# EAGLE design Board_ESP32_2Bluepill (EAGLE 9.7.0)
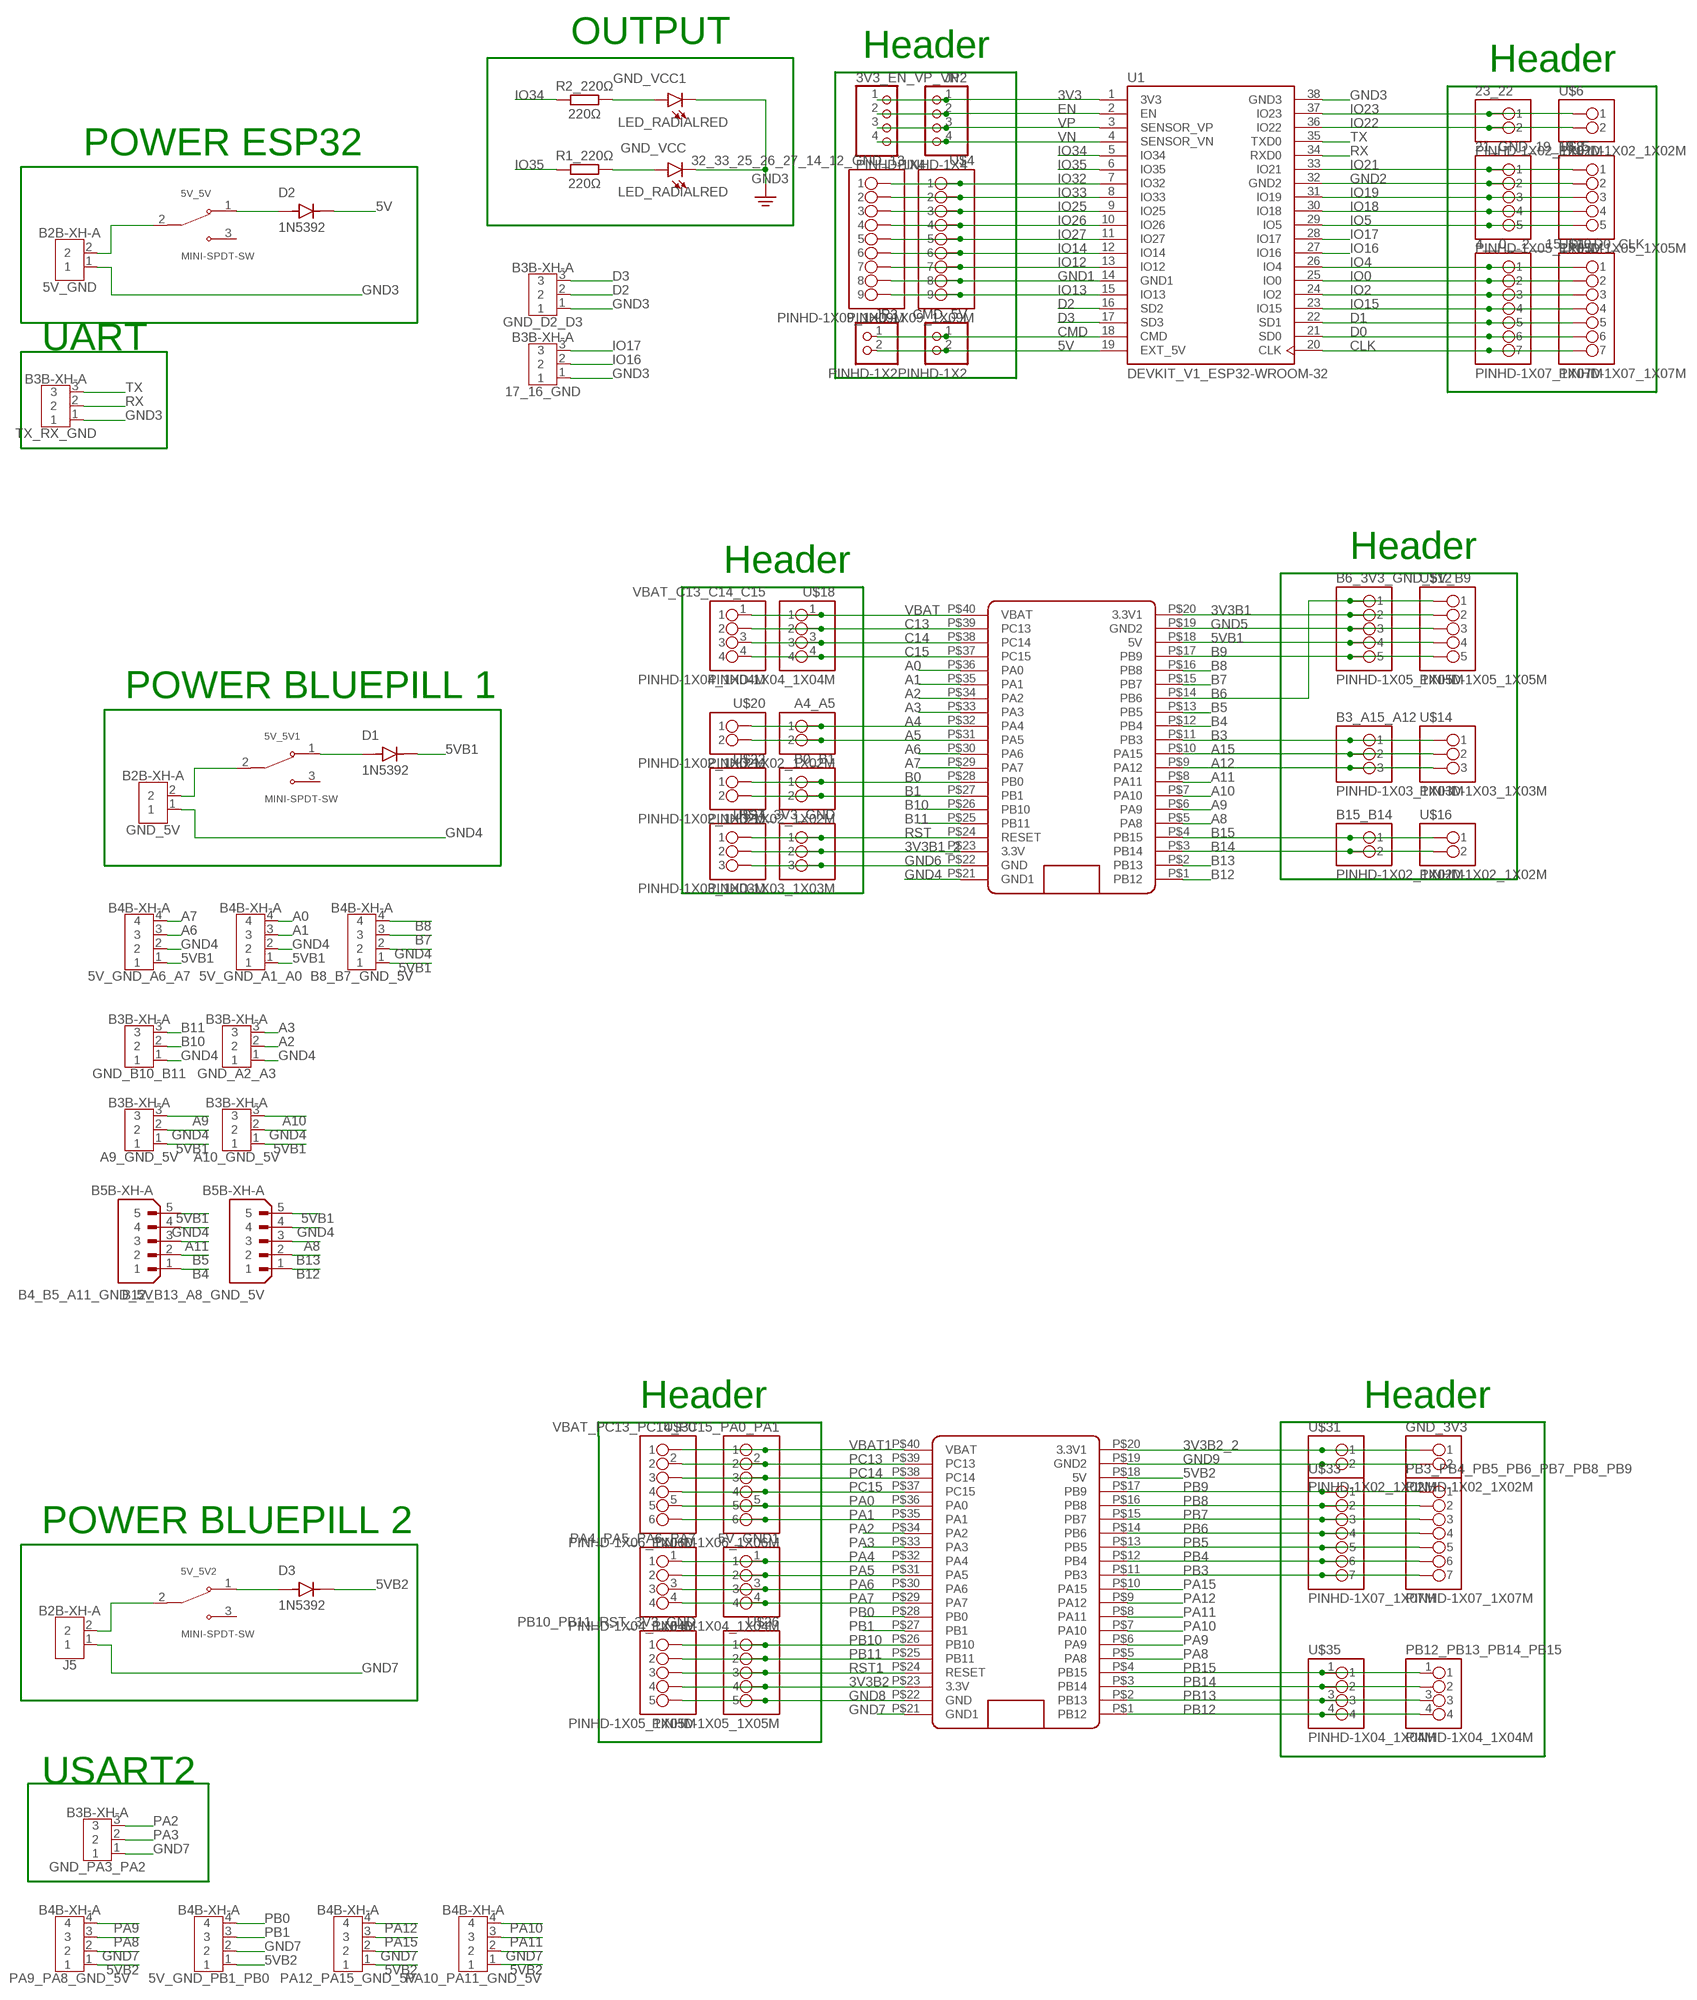
[diagram p0: schematic, sheet 1]

## Parts
3V3_EN_VP_VN  PINHD-1X4  [1X04]
4__0__2__15_D1_D0_CLK  PINHD-1X07_1X07M  [1X07]
5V_5V  MINI-SPDT-SW  [SW_MINI-SPDT-SW]
5V_5V1  MINI-SPDT-SW  [SW_MINI-SPDT-SW]
5V_5V2  MINI-SPDT-SW  [SW_MINI-SPDT-SW]
5V_GND  B2B-XH-A  [B2B-XH-A]
5V_GND1  PINHD-1X04_1X04M  [1X04]
5V_GND_A1_A0  B4B-XH-A  [B4B-XH-A]
5V_GND_A6_A7  B4B-XH-A  [B4B-XH-A]
5V_GND_PB1_PB0  B4B-XH-A  [B4B-XH-A]
17_16_GND  B3B-XH-A  [B3B-XH-A]
21_GND_19_18_5  PINHD-1X05_1X05M  [1X05]
23_22  PINHD-1X02_1X02M  [1X02]
32_33_25_26_27_14_12_GND_13  PINHD-1X09_1X09M  [1X09]
A4_A5  PINHD-1X02_1X02M  [1X02]
A9_GND_5V  B3B-XH-A  [B3B-XH-A]
A10_GND_5V  B3B-XH-A  [B3B-XH-A]
B0_B1  PINHD-1X02_1X02M  [1X02]
B3_A15_A12  PINHD-1X03_1X03M  [1X03]
B4_B5_A11_GND_5V  B5B-XH-A  [JST_B5B-XH-A]
B6_3V3_GND_5V_B9  PINHD-1X05_1X05M  [1X05]
B8_B7_GND_5V  B4B-XH-A  [B4B-XH-A]
B12_B13_A8_GND_5V  B5B-XH-A  [JST_B5B-XH-A]
B15_B14  PINHD-1X02_1X02M  [1X02]
CMD_5V  PINHD-1X2  [1X02]
D1  1N5392  [DIOAD1300W80L670D310]
D2  1N5392  [DIOAD1300W80L670D310]
D3  1N5392  [DIOAD1300W80L670D310]
GND_3V3  PINHD-1X02_1X02M  [1X02]
GND_5V  B2B-XH-A  [B2B-XH-A]
GND_A2_A3  B3B-XH-A  [B3B-XH-A]
GND_B10_B11  B3B-XH-A  [B3B-XH-A]
GND_D2_D3  B3B-XH-A  [B3B-XH-A]
GND_PA3_PA2  B3B-XH-A  [B3B-XH-A]
GND_VCC  LED_RADIALRED  [LEDRD254W60D565H860B_R]
GND_VCC1  LED_RADIALRED  [LEDRD254W60D565H860B_R]
J5  B2B-XH-A  [B2B-XH-A]
JP2  PINHD-1X4  [1X04]
JP3  PINHD-1X2  [1X02]
PA4_PA5_PA6_PA7  PINHD-1X04_1X04M  [1X04]
PA9_PA8_GND_5V  B4B-XH-A  [B4B-XH-A]
PA10_PA11_GND_5V  B4B-XH-A  [B4B-XH-A]
PA12_PA15_GND_5V  B4B-XH-A  [B4B-XH-A]
PB3_PB4_PB5_PB6_PB7_PB8_PB9  PINHD-1X07_1X07M  [1X07]
PB10_PB11_RST_3V3_GND  PINHD-1X05_1X05M  [1X05]
PB12_PB13_PB14_PB15  PINHD-1X04_1X04M  [1X04]
R1_220Ω  220Ω  R_AXIAL-11.7MM-PITCH  [RESAD1176W63L850D250B]
R2_220Ω  220Ω  R_AXIAL-11.7MM-PITCH  [RESAD1176W63L850D250B]
RST_3V3_GND  PINHD-1X03_1X03M  [1X03]
TX_RX_GND  B3B-XH-A  [B3B-XH-A]
U1  DEVKIT_V1_ESP32-WROOM-32  [MODULE_DEVKIT_V1_ESP32-WROOM-32]
U$1  BLUE_PILL  [BLUE_PILL]
U$2  BLUE_PILL  [BLUE_PILL]
U$4  PINHD-1X09_1X09M  [1X09]
U$6  PINHD-1X02_1X02M  [1X02]
U$8  PINHD-1X05_1X05M  [1X05]
U$10  PINHD-1X07_1X07M  [1X07]
U$12  PINHD-1X05_1X05M  [1X05]
U$14  PINHD-1X03_1X03M  [1X03]
U$16  PINHD-1X02_1X02M  [1X02]
U$18  PINHD-1X04_1X04M  [1X04]
U$20  PINHD-1X02_1X02M  [1X02]
U$22  PINHD-1X02_1X02M  [1X02]
U$24  PINHD-1X03_1X03M  [1X03]
U$26  PINHD-1X05_1X05M  [1X05]
U$30  PINHD-1X06_1X06M  [1X06]
U$31  PINHD-1X02_1X02M  [1X02]
U$33  PINHD-1X07_1X07M  [1X07]
U$35  PINHD-1X04_1X04M  [1X04]
VBAT_C13_C14_C15  PINHD-1X04_1X04M  [1X04]
VBAT_PC13_PC14_PC15_PA0_PA1  PINHD-1X06_1X06M  [1X06]

## Nets
3V3: 3V3_EN_VP_VN.1 JP2.1 U1.1(3V3)
3V3B1: B6_3V3_GND_5V_B9.2 U$1.P$20(3.3V1) U$12.2
3V3B1_2: RST_3V3_GND.2 U$1.P$23(3.3V) U$24.2
3V3B2: PB10_PB11_RST_3V3_GND.4 U$2.P$23(3.3V) U$26.4
3V3B2_2: GND_3V3.1 U$2.P$20(3.3V1) U$31.1
5V: CMD_5V.2 D2.C(K) JP3.2 U1.19(EXT_5V)
5V_FB1: 5V_5V.2 5V_GND.2
5V_FB2: 5V_5V1.2 GND_5V.2
5V_FB3: 5V_5V2.2 J5.2
5VB1: 5V_GND_A1_A0.1 5V_GND_A6_A7.1 A9_GND_5V.1 A10_GND_5V.1 B4_B5_A11_GND_5V.5 B6_3V3_GND_5V_B9.4 B8_B7_GND_5V.1 B12_B13_A8_GND_5V.5 D1.C(K) U$1.P$18(5V) U$12.4
5VB2: 5V_GND_PB1_PB0.1 D3.C(K) PA9_PA8_GND_5V.1 PA10_PA11_GND_5V.1 PA12_PA15_GND_5V.1 U$2.P$18(5V)
A0: 5V_GND_A1_A0.4 U$1.P$36(PA0)
A1: 5V_GND_A1_A0.3 U$1.P$35(PA1)
A2: GND_A2_A3.2 U$1.P$34(PA2)
A3: GND_A2_A3.3 U$1.P$33(PA3)
A4: A4_A5.1 U$1.P$32(PA4) U$20.1
A5: A4_A5.2 U$1.P$31(PA5) U$20.2
A6: 5V_GND_A6_A7.3 U$1.P$30(PA6)
A7: 5V_GND_A6_A7.4 U$1.P$29(PA7)
A8: B12_B13_A8_GND_5V.3 U$1.P$5(PA8)
A9: A9_GND_5V.3 U$1.P$6(PA9)
A10: A10_GND_5V.3 U$1.P$7(PA10)
A11: B4_B5_A11_GND_5V.3 U$1.P$8(PA11)
A12: B3_A15_A12.3 U$1.P$9(PA12) U$14.3
A15: B3_A15_A12.2 U$1.P$10(PA15) U$14.2
B0: B0_B1.1 U$1.P$28(PB0) U$22.1
B1: B0_B1.2 U$1.P$27(PB1) U$22.2
B3: B3_A15_A12.1 U$1.P$11(PB3) U$14.1
B4: B4_B5_A11_GND_5V.1 U$1.P$12(PB4)
B5: B4_B5_A11_GND_5V.2 U$1.P$13(PB5)
B6: B6_3V3_GND_5V_B9.1 U$1.P$14(PB6) U$12.1
B7: B8_B7_GND_5V.3 U$1.P$15(PB7)
B8: B8_B7_GND_5V.4 U$1.P$16(PB8)
B9: B6_3V3_GND_5V_B9.5 U$1.P$17(PB9) U$12.5
B10: GND_B10_B11.2 U$1.P$26(PB10)
B11: GND_B10_B11.3 U$1.P$25(PB11)
B12: B12_B13_A8_GND_5V.1 U$1.P$1(PB12)
B13: B12_B13_A8_GND_5V.2 U$1.P$2(PB13)
B14: B15_B14.2 U$1.P$3(PB14) U$16.2
B15: B15_B14.1 U$1.P$4(PB15) U$16.1
C13: U$1.P$39(PC13) U$18.2 VBAT_C13_C14_C15.2
C14: U$1.P$38(PC14) U$18.3 VBAT_C13_C14_C15.3
C15: U$1.P$37(PC15) U$18.4 VBAT_C13_C14_C15.4
CLK: 4__0__2__15_D1_D0_CLK.7 U1.20(CLK) U$10.7
CMD: CMD_5V.1 JP3.1 U1.18(CMD)
D0: 4__0__2__15_D1_D0_CLK.6 U1.21(SD0) U$10.6
D1: 4__0__2__15_D1_D0_CLK.5 U1.22(SD1) U$10.5
D2: GND_D2_D3.2 U1.16(SD2)
D3: GND_D2_D3.3 U1.17(SD3)
EN: 3V3_EN_VP_VN.2 JP2.2 U1.2(EN)
GND1: 32_33_25_26_27_14_12_GND_13.8 U1.14(GND1) U$4.8
GND2: 21_GND_19_18_5.2 U1.32(GND2) U$8.2
GND3: 5V_GND.1 17_16_GND.1 GND_D2_D3.1 GND_VCC1.C GND_VCC.C TX_RX_GND.1 U1.38(GND3) ; supply symbol labelled GND
GND4: 5V_GND_A1_A0.2 5V_GND_A6_A7.2 A9_GND_5V.2 A10_GND_5V.2 B4_B5_A11_GND_5V.4 B8_B7_GND_5V.2 B12_B13_A8_GND_5V.4 GND_5V.1 GND_A2_A3.1 GND_B10_B11.1 U$1.P$21(GND1)
GND5: B6_3V3_GND_5V_B9.3 U$1.P$19(GND2) U$12.3
GND6: RST_3V3_GND.3 U$1.P$22(GND) U$24.3
GND7: 5V_GND_PB1_PB0.2 GND_PA3_PA2.1 J5.1 PA9_PA8_GND_5V.2 PA10_PA11_GND_5V.2 PA12_PA15_GND_5V.2 U$2.P$21(GND1)
GND8: PB10_PB11_RST_3V3_GND.5 U$2.P$22(GND) U$26.5
GND9: GND_3V3.2 U$2.P$19(GND2) U$31.2
IO0: 4__0__2__15_D1_D0_CLK.2 U1.25(IO0) U$10.2
IO2: 4__0__2__15_D1_D0_CLK.3 U1.24(IO2) U$10.3
IO4: 4__0__2__15_D1_D0_CLK.1 U1.26(IO4) U$10.1
IO5: 21_GND_19_18_5.5 U1.29(IO5) U$8.5
IO12: 32_33_25_26_27_14_12_GND_13.7 U1.13(IO12) U$4.7
IO13: 32_33_25_26_27_14_12_GND_13.9 U1.15(IO13) U$4.9
IO14: 32_33_25_26_27_14_12_GND_13.6 U1.12(IO14) U$4.6
IO15: 4__0__2__15_D1_D0_CLK.4 U1.23(IO15) U$10.4
IO16: 17_16_GND.2 U1.27(IO16)
IO17: 17_16_GND.3 U1.28(IO17)
IO18: 21_GND_19_18_5.4 U1.30(IO18) U$8.4
IO19: 21_GND_19_18_5.3 U1.31(IO19) U$8.3
IO21: 21_GND_19_18_5.1 U1.33(IO21) U$8.1
IO22: 23_22.2 U1.36(IO22) U$6.2
IO23: 23_22.1 U1.37(IO23) U$6.1
IO25: 32_33_25_26_27_14_12_GND_13.3 U1.9(IO25) U$4.3
IO26: 32_33_25_26_27_14_12_GND_13.4 U1.10(IO26) U$4.4
IO27: 32_33_25_26_27_14_12_GND_13.5 U1.11(IO27) U$4.5
IO32: 32_33_25_26_27_14_12_GND_13.1 U1.7(IO32) U$4.1
IO33: 32_33_25_26_27_14_12_GND_13.2 U1.8(IO33) U$4.2
IO34: R2_220Ω.1 U1.5(IO34)
IO35: R1_220Ω.1 U1.6(IO35)
N$1: GND_VCC1.A R2_220Ω.2
N$2: GND_VCC.A R1_220Ω.2
N$9: 5V_5V.1 D2.A
N$19: 5V_5V2.1 D3.A
N$20: 5V_5V1.1 D1.A
PA0: U$2.P$36(PA0) U$30.5 VBAT_PC13_PC14_PC15_PA0_PA1.5
PA1: U$2.P$35(PA1) U$30.6 VBAT_PC13_PC14_PC15_PA0_PA1.6
PA2: GND_PA3_PA2.3 U$2.P$34(PA2)
PA3: GND_PA3_PA2.2 U$2.P$33(PA3)
PA4: 5V_GND1.1 PA4_PA5_PA6_PA7.1 U$2.P$32(PA4)
PA5: 5V_GND1.2 PA4_PA5_PA6_PA7.2 U$2.P$31(PA5)
PA6: 5V_GND1.3 PA4_PA5_PA6_PA7.3 U$2.P$30(PA6)
PA7: 5V_GND1.4 PA4_PA5_PA6_PA7.4 U$2.P$29(PA7)
PA8: PA9_PA8_GND_5V.3 U$2.P$5(PA8)
PA9: PA9_PA8_GND_5V.4 U$2.P$6(PA9)
PA10: PA10_PA11_GND_5V.4 U$2.P$7(PA10)
PA11: PA10_PA11_GND_5V.3 U$2.P$8(PA11)
PA12: PA12_PA15_GND_5V.4 U$2.P$9(PA12)
PA15: PA12_PA15_GND_5V.3 U$2.P$10(PA15)
PB0: 5V_GND_PB1_PB0.4 U$2.P$28(PB0)
PB1: 5V_GND_PB1_PB0.3 U$2.P$27(PB1)
PB3: PB3_PB4_PB5_PB6_PB7_PB8_PB9.7 U$2.P$11(PB3) U$33.7
PB4: PB3_PB4_PB5_PB6_PB7_PB8_PB9.6 U$2.P$12(PB4) U$33.6
PB5: PB3_PB4_PB5_PB6_PB7_PB8_PB9.5 U$2.P$13(PB5) U$33.5
PB6: PB3_PB4_PB5_PB6_PB7_PB8_PB9.4 U$2.P$14(PB6) U$33.4
PB7: PB3_PB4_PB5_PB6_PB7_PB8_PB9.3 U$2.P$15(PB7) U$33.3
PB8: PB3_PB4_PB5_PB6_PB7_PB8_PB9.2 U$2.P$16(PB8) U$33.2
PB9: PB3_PB4_PB5_PB6_PB7_PB8_PB9.1 U$2.P$17(PB9) U$33.1
PB10: PB10_PB11_RST_3V3_GND.1 U$2.P$26(PB10) U$26.1
PB11: PB10_PB11_RST_3V3_GND.2 U$2.P$25(PB11) U$26.2
PB12: PB12_PB13_PB14_PB15.4 U$2.P$1(PB12) U$35.4
PB13: PB12_PB13_PB14_PB15.3 U$2.P$2(PB13) U$35.3
PB14: PB12_PB13_PB14_PB15.2 U$2.P$3(PB14) U$35.2
PB15: PB12_PB13_PB14_PB15.1 U$2.P$4(PB15) U$35.1
PC13: U$2.P$39(PC13) U$30.2 VBAT_PC13_PC14_PC15_PA0_PA1.2
PC14: U$2.P$38(PC14) U$30.3 VBAT_PC13_PC14_PC15_PA0_PA1.3
PC15: U$2.P$37(PC15) U$30.4 VBAT_PC13_PC14_PC15_PA0_PA1.4
RST: RST_3V3_GND.1 U$1.P$24(RESET) U$24.1
RST1: PB10_PB11_RST_3V3_GND.3 U$2.P$24(RESET) U$26.3
RX: TX_RX_GND.2 U1.34(RXD0)
TX: TX_RX_GND.3 U1.35(TXD0)
VBAT: U$1.P$40(VBAT) U$18.1 VBAT_C13_C14_C15.1
VBAT1: U$2.P$40(VBAT) U$30.1 VBAT_PC13_PC14_PC15_PA0_PA1.1
VN: 3V3_EN_VP_VN.4 JP2.4 U1.4(SENSOR_VN)
VP: 3V3_EN_VP_VN.3 JP2.3 U1.3(SENSOR_VP)
Unconnected: 5V_5V1.3 5V_5V2.3 5V_5V.3

## Buses
B$1
B$2
B$3
B$4
B$5
B$6

## Notes on the sheet
- OUTPUT
- Header
- Header
- POWER ESP32
- UART
- Header
- Header
- POWER BLUEPILL 1
- Header | Header
- POWER BLUEPILL 2
- USART2

## Library data of the parts
3V3_EN_VP_VN JP2 = Connector:PINHD-1X4: PIN HEADER; CATEGORY: Headers; DESCRIPTION: Header-Straight-4 Position; PACKAGE_TYPE: THT; PITCH: 0.100" (2.54mm); SUBCATEGORY: Headers-Male Pins; TYPE: Board to Board or Cable-Unshrouded-Through Hole-Straight
4__0__2__15_D1_D0_CLK PB3_PB4_PB5_PB6_PB7_PB8_PB9 U$10 U$33 = Tinkercad:PINHD-1X07
5V_5V 5V_5V1 5V_5V2 = MINI-SPDT-SW:MINI-SPDT-SW: Simple breadboard friendly SPDT slide switch. Rated at 30V/200mA with operating force of 250 +/-100gf. Check availability <https://pricing.snapeda.com/parts/MINI-SPDT-SW/Gravitech/view-part?ref=eda>; AVAILABILITY: Not in stock; CHECK_PRICES: https://www.snapeda.com/parts/MINI-SPDT-SW/Gravitech/view-part/?ref=eda; DESCRIPTION: Slide Switches MINI SPDT SWITCH; MF: Gravitech; MP: MINI-SPDT-SW; PACKAGE: None; PRICE: None; SNAPEDA_LINK: https://www.snapeda.com/parts/MINI-SPDT-SW/Gravitech/view-part/?ref=snap
5V_GND GND_5V J5 = Connector:B2B-XH-A: XH Connector Top Entry - 2POS Details see: Datasheet <http://www.jst-mfg.com/product/pdf/eng/eXH.pdf>; CATEGORY: Header; DATASHEET: https://www.jst-mfg.com/product/pdf/eng/eXH.pdf?67404de0bbae1; DESCRIPTION: Connector Header Through Hole 2 position 0.098" (2.50mm); MANUFACTURER: JST Sales America Inc.; MPN: B2B-XH-A; OPERATING_TEMPERATURE: -25°C ~ 85°C; PACKAGE_SIZE: NA; PACKAGE_TYPE: THT; PART_STATUS: ACTIVE; PITCH: 0.098" (2.50mm); ROHS: COMPLIANT; SERIES: XH; SUBCATEGORY: Rectangular Connectors; TYPE: Header-Male Pin-Board to Cable/Wire-Through Hole
5V_GND1 PA4_PA5_PA6_PA7 PB12_PB13_PB14_PB15 U$18 U$35 VBAT_C13_C14_C15 = Tinkercad:PINHD-1X04
5V_GND_A1_A0 5V_GND_A6_A7 5V_GND_PB1_PB0 B8_B7_GND_5V PA9_PA8_GND_5V PA10_PA11_GND_5V PA12_PA15_GND_5V = Connector:B4B-XH-A: XH Connector Top Entry - 4POS Details see: Datasheet <http://www.jst-mfg.com/product/pdf/eng/eXH.pdf>; CATEGORY: Header; DATASHEET: https://www.jst-mfg.com/product/pdf/eng/eXH.pdf?67404de0bbae1; DESCRIPTION: Connector Header Through Hole 4 position 0.098" (2.50mm); MANUFACTURER: JST Sales America Inc.; MPN: B4B-XH-A; OPERATING_TEMPERATURE: -25°C ~ 85°C; PACKAGE_SIZE: NA; PACKAGE_TYPE: THT; PART_STATUS: ACTIVE; PITCH: 0.098" (2.50mm); ROHS: COMPLIANT; SERIES: XH; SUBCATEGORY: Rectangular Connectors; TYPE: Header-Male Pin-Board to Cable/Wire-Through Hole
17_16_GND A9_GND_5V A10_GND_5V GND_A2_A3 GND_B10_B11 GND_D2_D3 GND_PA3_PA2 TX_RX_GND = Connector:B3B-XH-A: XH Connector Top Entry - 3POS Details see: Datasheet <http://www.jst-mfg.com/product/pdf/eng/eXH.pdf>; CATEGORY: Header; DATASHEET: https://www.jst-mfg.com/product/pdf/eng/eXH.pdf?67404de0bbae1; DESCRIPTION: Connector Header Through Hole 3 position 0.098" (2.50mm); MANUFACTURER: JST Sales America Inc.; MPN: B3B-XH-A; OPERATING_TEMPERATURE: -25°C ~ 85°C; PACKAGE_SIZE: NA; PACKAGE_TYPE: THT; PART_STATUS: ACTIVE; PITCH: 0.098" (2.50mm); ROHS: COMPLIANT; SERIES: XH; SUBCATEGORY: Rectangular Connectors; TYPE: Header-Male Pin-Board to Cable/Wire-Through Hole
21_GND_19_18_5 B6_3V3_GND_5V_B9 PB10_PB11_RST_3V3_GND U$8 U$12 U$26 = Tinkercad:PINHD-1X05
23_22 A4_A5 B0_B1 B15_B14 GND_3V3 U$6 U$16 U$20 U$22 U$31 = Tinkercad:PINHD-1X02
32_33_25_26_27_14_12_GND_13 U$4 = Tinkercad:PINHD-1X09
B3_A15_A12 RST_3V3_GND U$14 U$24 = Tinkercad:PINHD-1X03
B4_B5_A11_GND_5V B12_B13_A8_GND_5V = B5B-XH-A:B5B-XH-A: Check availability <https://pricing.snapeda.com/parts/B5B-XH-A/JST%20Sales/view-part?ref=eda>; AVAILABILITY: In Stock; CHECK_PRICES: https://www.snapeda.com/parts/B5B-XH-A/JST/view-part/?ref=eda; DESCRIPTION: Connector Header Through Hole 5 position 0.098 (2.50mm); MF: JST Sales; MP: B5B-XH-A; PACKAGE: None; PRICE: None; SNAPEDA_LINK: https://www.snapeda.com/parts/B5B-XH-A/JST/view-part/?ref=snap
CMD_5V JP3 = Connector:PINHD-1X2: PIN HEADER; CATEGORY: Headers; DESCRIPTION: Header-Straight-2 Position; PACKAGE_TYPE: THT; PITCH: 0.100" (2.54mm); SUBCATEGORY: Headers-Male Pins; TYPE: Board to Board or Cable-Unshrouded-Through Hole-Straight
D1-D3 = 1N5392:1N5392: Check availability <https://pricing.snapeda.com/parts/1N5392/ON%20Semiconductor/view-part?ref=eda>; AVAILABILITY: In Stock; CHECK_PRICES: https://www.snapeda.com/parts/1N5392/Onsemi/view-part/?ref=eda; DESCRIPTION: Diode Standard 100 V 1.5A Through Hole DO-15; MF: ON Semiconductor; MP: 1N5392; PACKAGE: None; PRICE: None; SNAPEDA_LINK: https://www.snapeda.com/parts/1N5392/Onsemi/view-part/?ref=snap
GND_VCC GND_VCC1 = Opto-Electronic:LED_RADIAL: LED - Generic
R1_220Ω R2_220Ω = Resistor:R: Resistor Fixed - Generic; CATEGORY: Resistor; SUB-CATEGORY: Fixed
U1 = DEVKIT_V1_ESP32-WROOM-32:DEVKIT_V1_ESP32-WROOM-32: Check availability <https://pricing.snapeda.com/parts/DEVKIT%20V1%20ESP32-WROOM-32/Espressif%20Systems/view-part?ref=eda>; AVAILABILITY: Not in stock; CHECK_PRICES: https://www.snapeda.com/parts/DEVKIT%20V1%20ESP32-WROOM-32/Espressif+Systems/view-part/?ref=eda; DESCRIPTION: WROOM-32 Development Board ESP32 ESP-32S WiFi Bluetooth Dev Module; MF: Espressif Systems; MP: DEVKIT V1 ESP32-WROOM-32; PACKAGE: Package; PRICE: None; SNAPEDA_LINK: https://www.snapeda.com/parts/DEVKIT%20V1%20ESP32-WROOM-32/Espressif+Systems/view-part/?ref=snap
U$1 U$2 = BluePill:BLUE_PILL
U$30 VBAT_PC13_PC14_PC15_PA0_PA1 = Tinkercad:PINHD-1X06

## Board
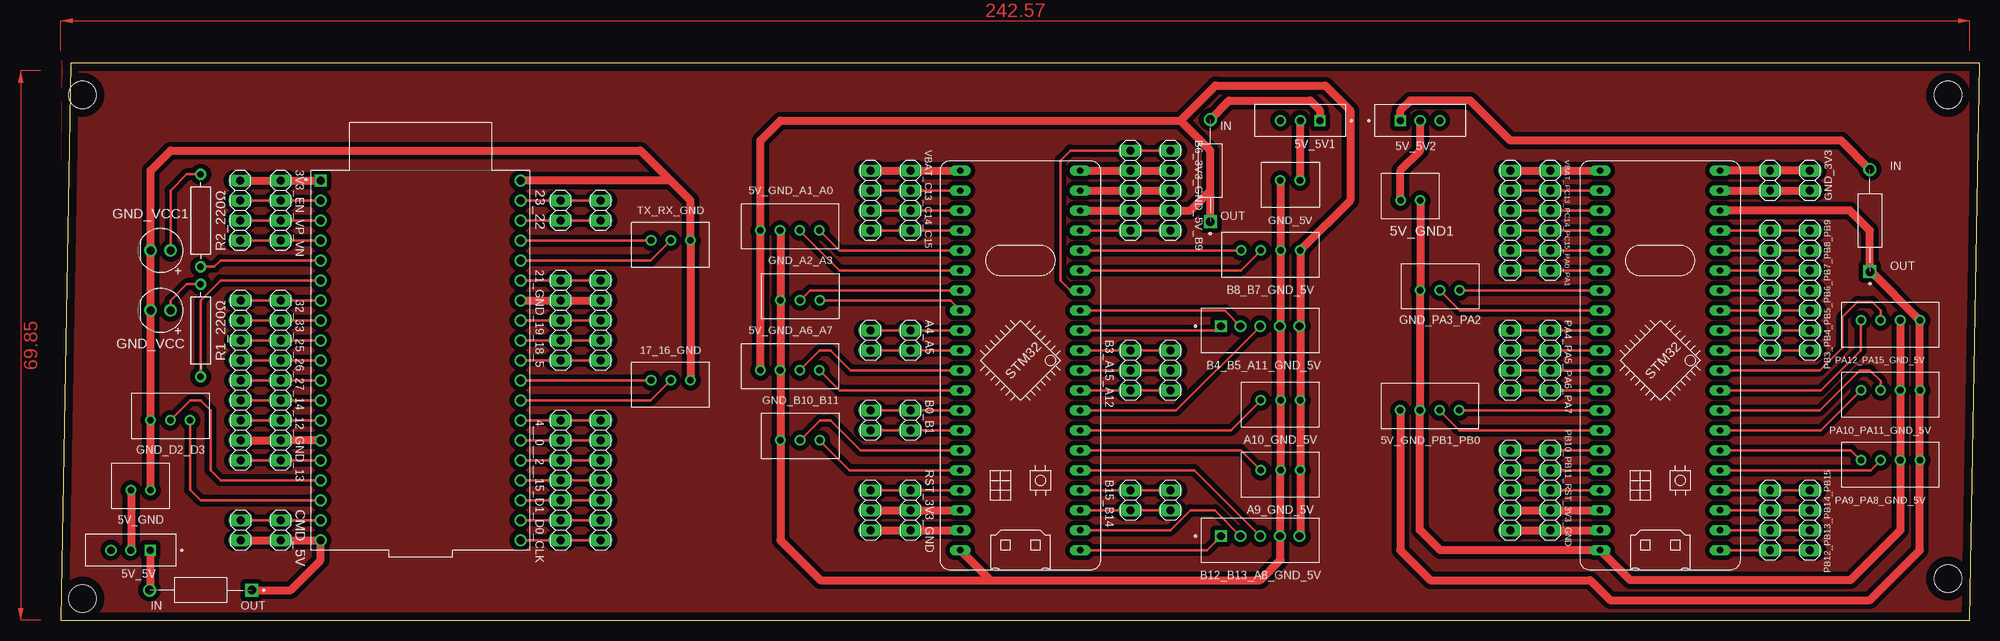
[diagram p1: board, top side]
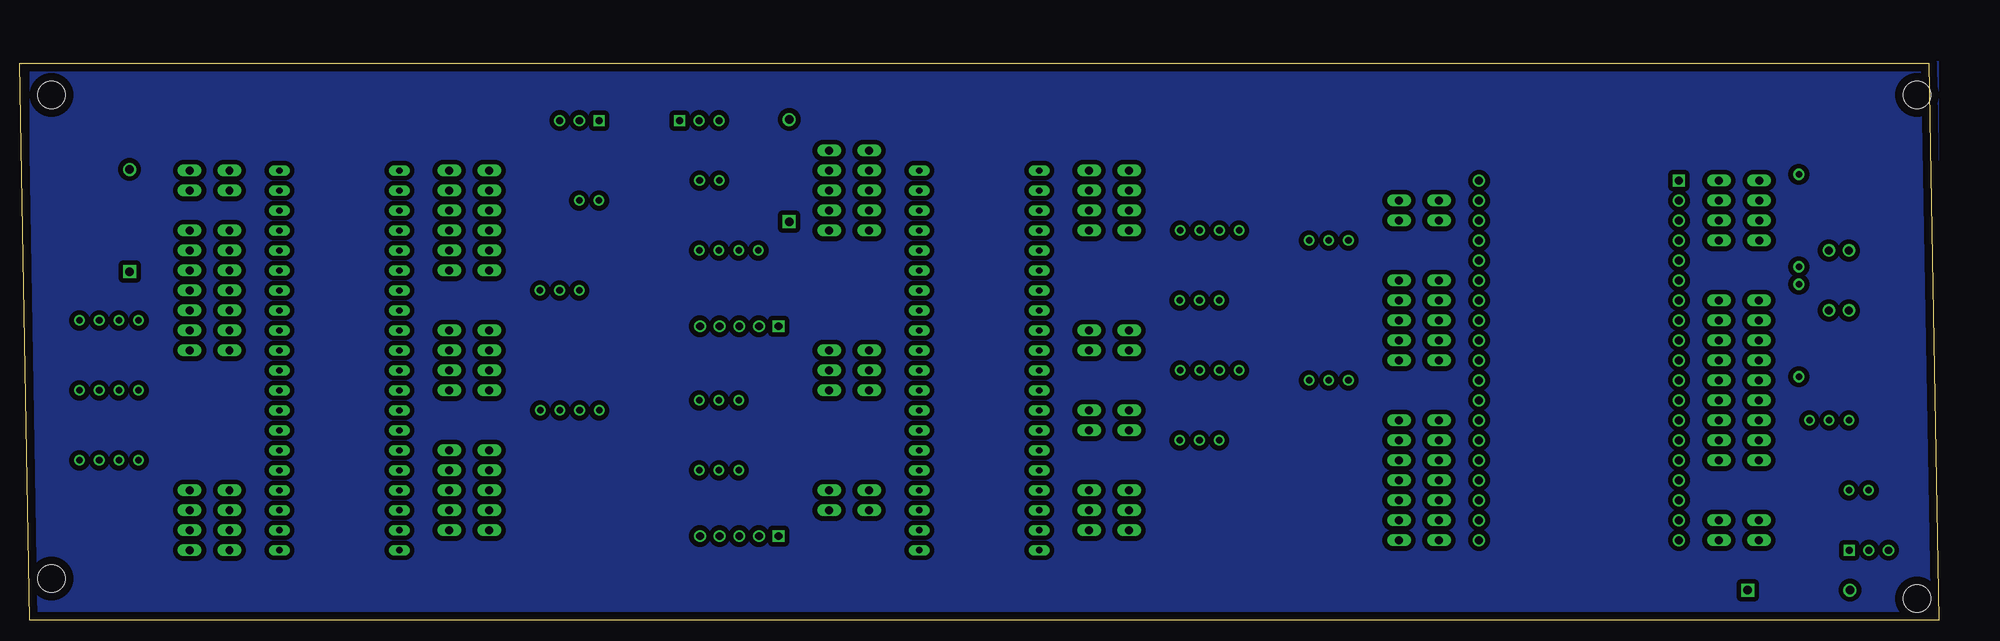
[diagram p2: board, bottom side, seen from below]

Size 243.82 x 70.79 mm. Coordinates in mm from the lower left corner, seen from the top.
Outline: 0,0 242.55,0 243.82,70.79 1.27,70.79 0,0
Copper layers (1*16): Top 0.035mm / dielectric 1.5mm / Bottom 0.035mm
Design rules "Fusion Electronics Design Rules": minimum track width 0.3mm, minimum drill 0.75mm, track to track 0.6mm, track to pad 0.25mm, pad to pad 0.25mm, via to via 6mil, smd to smd 6mil, copper to edge 40mil, drill to drill 0.6mm, minimum pad ring 10mil, minimum via ring 8mil, stop-mask expansion 4mil, vias tented up to drill 9999mil, thermal gap 10mil
Holes 3.5 mm at 239.78,66.75 2.77,66.75 2.77,2.77 239.78,5.31

### Footprints (pad centres in the part's own frame; a part is rotated, then mirrored left to right if it is on the bottom)
1X04 = drill 1.016 long: 1 -3.81,0; 2 -1.27,0; 3 1.27,0; 4 3.81,0
1X07 = drill 1.016 long: 1 -7.62,0; 2 -5.08,0; 3 -2.54,0; 4 0,0; 5 2.54,0; 6 5.08,0; 7 7.62,0
SW_MINI-SPDT-SW = drill 0.9 square: 1 -2.5,0 | drill 0.9: 2 0,0; 3 2.5,0
B2B-XH-A = drill 0.84: 1 0,0; 2 2.5,0
B4B-XH-A = drill 0.84: 1 0,0; 2 2.5,0; 3 5,0; 4 7.5,0
B3B-XH-A = drill 0.84: 1 0,0; 2 2.5,0; 3 5,0
1X05 = drill 1.016 long: 1 -5.08,0; 2 -2.54,0; 3 0,0; 4 2.54,0; 5 5.08,0
1X02 = drill 1.016 long: 1 -1.27,0; 2 1.27,0
1X09 = drill 1.016 long: 1 -10.16,0; 2 -7.62,0; 3 -5.08,0; 4 -2.54,0; 5 0,0; 6 2.54,0; 7 5.08,0; 8 7.62,0; 9 10.16,0
1X03 = drill 1.016 long: 1 -2.54,0; 2 0,0; 3 2.54,0
JST_B5B-XH-A = drill 1 square: 1 5,-0.525 | drill 1: 2 2.5,-0.525; 3 0,-0.525; 4 -2.5,-0.525; 5 -5,-0.525
DIOAD1300W80L670D310 = drill 1.1: A 6.5,0 | drill 1.1 square: C -6.5,0
LEDRD254W60D565H860B_R = drill 0.981 pad 1.581: A -1.27,0; C 1.27,0
RESAD1176W63L850D250B = drill 0.83 pad 1.43: 1 -5.88,0; 2 5.88,0
MODULE_DEVKIT_V1_ESP32-WROOM-32 = drill 1.02 square: 1 -12.7,22.85 | drill 1.02: 2 -12.7,20.31; 3 -12.7,17.77; 4 -12.7,15.23; 5 -12.7,12.69; 6 -12.7,10.15; 7 -12.7,7.61; 8 -12.7,5.07; 9 -12.7,2.53; 10 -12.7,-0.01; 11 -12.7,-2.55; 12 -12.7,-5.09; 13 -12.7,-7.63; 14 -12.7,-10.17; 15 -12.7,-12.71; 16 -12.7,-15.25; 17 -12.7,-17.79; 18 -12.7,-20.33; 19 -12.7,-22.87; 20 12.7,-22.87; 21 12.7,-20.33; 22 12.7,-17.79; 23 12.7,-15.25; 24 12.7,-12.71; 25 12.7,-10.17; 26 12.7,-7.63; 27 12.7,-5.09; 28 12.7,-2.55; 29 12.7,-0.01; 30 12.7,2.53; 31 12.7,5.07; 32 12.7,7.61; 33 12.7,10.15; 34 12.7,12.69; 35 12.7,15.23; 36 12.7,17.77; 37 12.7,20.31; 38 12.7,22.85
BLUE_PILL = drill 0.8 long: P$1 -7.62,15.24; P$2 -7.62,12.7; P$3 -7.62,10.16; P$4 -7.62,7.62; P$5 -7.62,5.08; P$6 -7.62,2.54; P$7 -7.62,0; P$8 -7.62,-2.54; P$9 -7.62,-5.08; P$10 -7.62,-7.62; P$11 -7.62,-10.16; P$12 -7.62,-12.7; P$13 -7.62,-15.24; P$14 -7.62,-17.78; P$15 -7.62,-20.32; P$16 -7.62,-22.86; P$17 -7.62,-25.4; P$18 -7.62,-27.94; P$19 -7.62,-30.48; P$20 -7.62,-33.02; P$21 7.62,15.24; P$22 7.62,12.7; P$23 7.62,10.16; P$24 7.62,7.62; P$25 7.62,5.08; P$26 7.62,2.54; P$27 7.62,0; P$28 7.62,-2.54; P$29 7.62,-5.08; P$30 7.62,-7.62; P$31 7.62,-10.16; P$32 7.62,-12.7; P$33 7.62,-15.24; P$34 7.62,-17.78; P$35 7.62,-20.32; P$36 7.62,-22.86; P$37 7.62,-25.4; P$38 7.62,-27.94; P$39 7.62,-30.48; P$40 7.62,-33.02
1X06 = drill 1.016 long: 1 -6.35,0; 2 -3.81,0; 3 -1.27,0; 4 1.27,0; 5 3.81,0; 6 6.35,0

### Placement (x,y rotation side)
3V3_EN_VP_VN  27.94,52.07 270 top
4__0__2__15_D1_D0_CLK  63.5,17.78 270 top
5V_5V  8.89,8.89 180 top
5V_5V1  157.48,63.5 180 top
5V_5V2  172.72,63.5 0 top
5V_GND  11.43,16.51 180 top
5V_GND1  184.15,33.02 270 top
5V_GND_A1_A0  88.9,49.53 0 top
5V_GND_A6_A7  88.9,31.75 0 top
5V_GND_PB1_PB0  170.18,26.67 0 top
17_16_GND  80.01,30.48 180 top
21_GND_19_18_5  63.5,38.1 270 top
23_22  63.5,52.07 270 top
32_33_25_26_27_14_12_GND_13  27.94,30.48 270 top
A4_A5  107.95,35.56 270 top
A9_GND_5V  157.48,19.05 180 top
A10_GND_5V  157.48,27.94 180 top
B0_B1  107.95,25.4 270 top
B3_A15_A12  135.89,31.75 270 top
B4_B5_A11_GND_5V  152.4,36.83 180 top
B6_3V3_GND_5V_B9  135.89,54.61 270 top
B8_B7_GND_5V  157.48,46.99 180 top
B12_B13_A8_GND_5V  152.4,10.16 180 top
B15_B14  135.89,15.24 270 top
CMD_5V  27.94,11.43 270 top
D1  146.05,57.15 90 top
D2  17.78,3.81 180 top
D3  229.87,50.8 90 top
GND_3V3  222.25,55.88 270 top
GND_5V  154.94,55.88 0 top
GND_A2_A3  91.44,40.64 0 top
GND_B10_B11  91.44,22.86 0 top
GND_D2_D3  11.43,25.4 0 top
GND_PA3_PA2  172.72,41.91 0 top
GND_VCC  12.7,39.37 180 top
GND_VCC1  12.7,46.99 180 top
J5  172.72,53.34 180 top
JP2  22.84,52.07 270 top
JP3  22.86,11.43 270 top
PA4_PA5_PA6_PA7  189.23,33.02 270 top
PA9_PA8_GND_5V  236.22,20.32 180 top
PA10_PA11_GND_5V  236.22,29.21 180 top
PA12_PA15_GND_5V  236.22,38.1 180 top
PB3_PB4_PB5_PB6_PB7_PB8_PB9  222.25,41.91 270 top
PB10_PB11_RST_3V3_GND  189.23,16.51 270 top
PB12_PB13_PB14_PB15  222.25,12.7 270 top
R1_220Ω  17.78,36.83 90 top
R2_220Ω  17.78,50.8 90 top
RST_3V3_GND  107.95,13.97 270 top
TX_RX_GND  80.01,48.26 180 top
U1  45.72,33.02 0 top
U$1  121.92,24.13 180 top
U$2  203.2,24.13 180 top
U$4  22.86,30.48 270 top
U$6  68.58,52.07 270 top
U$8  68.58,38.1 270 top
U$10  68.58,17.78 270 top
U$12  140.97,54.61 270 top
U$14  140.97,31.75 270 top
U$16  140.97,15.24 270 top
U$18  102.87,53.34 270 top
U$20  102.87,35.56 270 top
U$22  102.87,25.4 270 top
U$24  102.87,13.97 270 top
U$26  184.15,16.51 270 top
U$30  184.15,50.8 270 top
U$31  217.17,55.88 270 top
U$33  217.17,41.91 270 top
U$35  217.17,12.7 270 top
VBAT_C13_C14_C15  107.95,53.34 270 top
VBAT_PC13_PC14_PC15_PA0_PA1  189.23,50.8 270 top

### Tracks (layer width: path | path; a pad name or v marks a point on that pad's centre or on a via)
3V3
  Top 1.016: JP2.1 3V3_EN_VP_VN.1 U1.1
3V3B1
  Top 1.016: U$1.P$20 B6_3V3_GND_5V_B9.2 U$12.2
3V3B1_2
  Top 1.016: U$24.2 RST_3V3_GND.2 U$1.P$23
3V3B2
  Top 1.016: U$26.4 PB10_PB11_RST_3V3_GND.4 U$2.P$23
3V3B2_2
  Top 1.016: GND_3V3.1 U$31.1 U$2.P$20
5V
  Top 1.016: JP3.2 CMD_5V.2 U1.19 33.02,7.62 29.21,3.81 D2.C
5V_FB1
  Top 1.016: 5V_GND.2 8.93,8.93 5V_5V.2
5V_FB2
  Top 1.016: GND_5V.2 157.48,55.92 5V_5V1.2
5V_FB3
  Top 1.016: J5.2 170.22,57.19 172.72,59.69 5V_5V2.2
5VB1
  Top 1.016: B12_B13_A8_GND_5V.5 157.48,10.77 A9_GND_5V.1 A10_GND_5V.1 157.48,37.27 B4_B5_A11_GND_5V.5 157.48,37.43 B8_B7_GND_5V.1 157.48,47.14 157.63,47.14 163.83,53.34 163.83,64.77 160.66,67.95 146.69,67.95 | U$1.P$18 B6_3V3_GND_5V_B9.4 U$12.4 143.51,52.07 146.05,54.61 | 5V_GND_A6_A7.1 5V_GND_A1_A0.1 88.9,60.96 91.44,63.5 142.24,63.5 | 142.24,63.5 146.69,67.95 | 146.69,67.95 146.74,68 | D1.C 146.05,54.61 | 146.05,54.61 146.05,59.69 142.24,63.5
5VB2
  Top 1.016: 5V_GND_PB1_PB0.1 170.18,8.89 173.99,5.08 194.31,5.08 196.85,2.54 229.87,2.54 236.22,8.89 PA9_PA8_GND_5V.1 PA10_PA11_GND_5V.1 PA12_PA15_GND_5V.1 230.02,44.3 D3.C 229.87,49.53 227.33,52.07 U$2.P$18
A0
  Top 0.305: 5V_GND_A1_A0.4 98.94,46.99 U$1.P$36
A1
  Top 0.305: 5V_GND_A1_A0.3 98.98,44.45 U$1.P$35
A2
  Top 0.305: GND_A2_A3.2 95.21,41.91 U$1.P$34
A3
  Top 0.305: U$1.P$33 113.03,40.64 GND_A2_A3.3
A4
  Top 0.305: U$20.1 A4_A5.1 U$1.P$32
A5
  Top 0.305: U$20.2 A4_A5.2 U$1.P$31
A6
  Top 0.305: U$1.P$30 100.33,31.75 97.79,34.29 96.44,34.29 5V_GND_A6_A7.3
A7
  Top 0.305: 5V_GND_A6_A7.4 98.94,29.21 U$1.P$29
A8
  Top 0.305: B12_B13_A8_GND_5V.3 144.03,19.05 U$1.P$5
A9
  Top 0.305: A9_GND_5V.3 149.94,21.59 U$1.P$6
A10
  Top 0.305: A10_GND_5V.3 148.67,24.13 U$1.P$7
A11
  Top 0.305: B4_B5_A11_GND_5V.3 141.72,26.67 U$1.P$8
A12
  Top 0.3: U$1.P$9 B3_A15_A12.3 U$14.3
A15
  Top 0.3: U$14.2 B3_A15_A12.2 U$1.P$10
B0
  Top 0.305: U$1.P$28 B0_B1.1 U$22.1
B1
  Top 0.305: U$22.2 B0_B1.2 U$1.P$27
B3
  Top 0.3: U$1.P$11 B3_A15_A12.1 U$14.1
B4
  Top 0.305: U$1.P$12 146.88,36.83 B4_B5_A11_GND_5V.1
B5
  Top 0.305: U$1.P$13 147.89,39.37 B4_B5_A11_GND_5V.2
B6
  Top 0.3: U$1.P$14 128.27,41.91 127,43.18 127,58.42 128.27,59.69 B6_3V3_GND_5V_B9.1 U$12.1
B7
  Top 0.3: U$1.P$15 149.94,44.45 B8_B7_GND_5V.3
B8
  Top 0.3: U$1.P$16 B8_B7_GND_5V.4
B9
  Top 0.305: U$1.P$17 B6_3V3_GND_5V_B9.5 U$12.5
B10
  Top 0.305: GND_B10_B11.2 96.48,25.4 97.79,25.4 101.6,21.59 U$1.P$26
B11
  Top 0.305: GND_B10_B11.3 100.25,19.05 U$1.P$25
B12
  Top 0.305: B12_B13_A8_GND_5V.1 145.61,8.89 U$1.P$1
B13
  Top 0.305: U$1.P$2 140.97,11.43 143.51,13.97 146.62,13.97 B12_B13_A8_GND_5V.2
B14
  Top 0.3: U$1.P$3 B15_B14.2 U$16.2
B15
  Top 0.3: U$1.P$4 B15_B14.1 U$16.1
C13
  Top 0.305: U$18.2 VBAT_C13_C14_C15.2 U$1.P$39
C14
  Top 0.305: U$18.3 VBAT_C13_C14_C15.3 U$1.P$38
C15
  Top 0.305: U$18.4 VBAT_C13_C14_C15.4 U$1.P$37
CLK
  Top 0.305: U1.20 4__0__2__15_D1_D0_CLK.7 U$10.7
CMD
  Top 0.305: JP3.1 CMD_5V.1 U1.18
D0
  Top 0.305: U1.21 4__0__2__15_D1_D0_CLK.6 U$10.6
D1
  Top 0.305: U1.22 4__0__2__15_D1_D0_CLK.5 U$10.5
D2
  Top 0.305: U1.16 20.33,17.77 19.05,19.05 19.05,26.67 17.78,27.94 16.47,27.94 GND_D2_D3.2
D3
  Top 0.305: U1.17 17.79,15.23 16.43,16.59 GND_D2_D3.3
EN
  Top 0.305: JP2.2 3V3_EN_VP_VN.2 U1.2
GND
  pour Bottom: 0.08,0.08 242.49,0.08 242.49,71.04 0.08,71.04
GND1
  Top 1.016: U$4.8 32_33_25_26_27_14_12_GND_13.8 U1.14
GND2
  Top 1.016: U1.32 21_GND_19_18_5.2 U$8.2
GND3
  Top 1.016: 17_16_GND.1 TX_RX_GND.1 80.01,53.34 77.47,55.88 | U1.38 77.47,55.88 | 5V_GND.1 GND_D2_D3.1 GND_VCC.C GND_VCC1.C 11.43,57.15 13.97,59.69 73.66,59.69 77.47,55.88
GND4
  Top 1.016: 154.98,10.77 A9_GND_5V.2 A10_GND_5V.2 154.98,37.27 B4_B5_A11_GND_5V.4 154.98,37.43 B8_B7_GND_5V.2 154.98,55.84 GND_5V.1 | 154.98,10.77 B12_B13_A8_GND_5V.4 | U$1.P$21 118.11,5.08 | 118.11,5.08 152.4,5.08 154.98,7.66 154.98,10.77 | 5V_GND_A1_A0.2 91.44,49.49 GND_A2_A3.1 91.44,31.79 5V_GND_A6_A7.2 91.44,31.71 GND_B10_B11.1 91.44,10.16 96.52,5.08 118.11,5.08
GND5
  Top 1.016: U$1.P$19 B6_3V3_GND_5V_B9.3 U$12.3
GND6
  Top 1.016: U$24.3 RST_3V3_GND.3 U$1.P$22
GND7
  Top 1.016: PA12_PA15_GND_5V.2 PA10_PA11_GND_5V.2 PA9_PA8_GND_5V.2 233.72,11.43 227.37,5.08 199.39,5.08 U$2.P$21 175.26,8.89 172.68,11.47 5V_GND_PB1_PB0.2 172.72,26.71 GND_PA3_PA2.1 J5.1
GND8
  Top 1.016: U$26.5 PB10_PB11_RST_3V3_GND.5 U$2.P$22
GND9
  Top 1.016: U$2.P$19 U$31.2 GND_3V3.2
IO0
  Top 0.305: U1.25 4__0__2__15_D1_D0_CLK.2 U$10.2
IO2
  Top 0.305: U1.24 4__0__2__15_D1_D0_CLK.3 U$10.3
IO4
  Top 0.305: U$10.1 4__0__2__15_D1_D0_CLK.1 U1.26
IO5
  Top 0.305: U$8.5 21_GND_19_18_5.5 U1.29
IO12
  Top 0.305: U$4.7 32_33_25_26_27_14_12_GND_13.7 U1.13
IO13
  Top 0.305: U$4.9 32_33_25_26_27_14_12_GND_13.9 U1.15
IO14
  Top 0.305: U$4.6 32_33_25_26_27_14_12_GND_13.6 U1.12
IO15
  Top 0.305: U1.23 4__0__2__15_D1_D0_CLK.4 U$10.4
IO16
  Top 0.305: U1.27 74.97,27.94 17_16_GND.2
IO17
  Top 0.305: 17_16_GND.3 U1.28
IO18
  Top 0.305: U1.30 21_GND_19_18_5.4 U$8.4
IO19
  Top 0.305: U$8.3 21_GND_19_18_5.3 U1.31
IO21
  Top 0.305: U1.33 21_GND_19_18_5.1 U$8.1
IO22
  Top 0.305: U1.36 23_22.2 U$6.2
IO23
  Top 0.305: U1.37 23_22.1 U$6.1
IO25
  Top 0.305: U$4.3 32_33_25_26_27_14_12_GND_13.3 U1.9
IO26
  Top 0.305: U$4.4 32_33_25_26_27_14_12_GND_13.4 U1.10
IO27
  Top 0.305: U$4.5 32_33_25_26_27_14_12_GND_13.5 U1.11
IO32
  Top 0.305: U$4.1 32_33_25_26_27_14_12_GND_13.1 U1.7
IO33
  Top 0.305: U$4.2 32_33_25_26_27_14_12_GND_13.2 U1.8
IO34
  Top 0.305: R2_220Ω.1 19.52,44.92 20.32,45.72 U1.5
IO35
  Top 0.305: R1_220Ω.1 17.78,40.64 20.32,43.18 U1.6
N$1
  Top 0.305: R2_220Ω.2 16.04,56.68 13.97,54.61 GND_VCC1.A
N$2
  Top 0.305: R1_220Ω.2 16.04,42.71 13.97,40.64 GND_VCC.A
N$9
  Top 1.016: 5V_5V.1 11.39,3.92 D2.A
N$19
  Top 1.016: 5V_5V2.1 170.22,64.81 171.45,66.04 179.07,66.04 184.15,60.96 226.21,60.96 D3.A
N$20
  Top 1.016: D1.A 148.44,66.04 158.75,66.04 159.98,64.81 5V_5V1.1
PA0
  Top 0.305: U$30.5 VBAT_PC13_PC14_PC15_PA0_PA1.5 U$2.P$36
PA1
  Top 0.305: U$30.6 VBAT_PC13_PC14_PC15_PA0_PA1.6 U$2.P$35
PA2
  Top 0.305: U$2.P$34 GND_PA3_PA2.3
PA3
  Top 0.305: GND_PA3_PA2.2 177.76,39.37 U$2.P$33
PA4
  Top 0.305: U$2.P$32 PA4_PA5_PA6_PA7.1 5V_GND1.1
PA5
  Top 0.305: 5V_GND1.2 PA4_PA5_PA6_PA7.2 U$2.P$31
PA6
  Top 0.305: U$2.P$30 PA4_PA5_PA6_PA7.3 5V_GND1.3
PA7
  Top 0.305: 5V_GND1.4 PA4_PA5_PA6_PA7.4 U$2.P$29
PA8
  Top 0.305: U$2.P$5 229.95,19.05 PA9_PA8_GND_5V.3
PA9
  Top 0.305: U$2.P$6 227.45,21.59 PA9_PA8_GND_5V.4
PA10
  Top 0.305: PA10_PA11_GND_5V.4 223.64,24.13 U$2.P$7
PA11
  Top 0.305: U$2.P$8 223.52,26.67 228.6,31.75 229.87,31.75 231.22,30.4 PA10_PA11_GND_5V.3
PA12
  Top 0.305: PA12_PA15_GND_5V.4 228.72,34.29 223.64,29.21 U$2.P$9
PA15
  Top 0.305: U$2.P$10 223.52,31.75 226.37,34.6 226.37,38.55 228.27,40.45 230.14,40.45 231.22,39.37 PA12_PA15_GND_5V.3
PB0
  Top 0.305: U$2.P$28 5V_GND_PB1_PB0.4
PB1
  Top 0.305: 5V_GND_PB1_PB0.3 177.72,24.13 U$2.P$27
PB3
  Top 0.305: PB3_PB4_PB5_PB6_PB7_PB8_PB9.7 U$33.7 U$2.P$11
PB4
  Top 0.305: U$2.P$12 U$33.6 PB3_PB4_PB5_PB6_PB7_PB8_PB9.6
PB5
  Top 0.305: U$2.P$13 U$33.5 PB3_PB4_PB5_PB6_PB7_PB8_PB9.5
PB6
  Top 0.305: PB3_PB4_PB5_PB6_PB7_PB8_PB9.4 U$33.4 U$2.P$14
PB7
  Top 0.305: U$2.P$15 U$33.3 PB3_PB4_PB5_PB6_PB7_PB8_PB9.3
PB8
  Top 0.305: U$2.P$16 U$33.2 PB3_PB4_PB5_PB6_PB7_PB8_PB9.2
PB9
  Top 0.305: U$2.P$17 U$33.1 PB3_PB4_PB5_PB6_PB7_PB8_PB9.1
PB10
  Top 0.305: U$2.P$26 PB10_PB11_RST_3V3_GND.1 U$26.1
PB11
  Top 0.305: U$26.2 PB10_PB11_RST_3V3_GND.2 U$2.P$25
PB12
  Top 0.305: U$2.P$1 U$35.4 PB12_PB13_PB14_PB15.4
PB13
  Top 0.305: U$2.P$2 U$35.3 PB12_PB13_PB14_PB15.3
PB14
  Top 0.305: U$2.P$3 U$35.2 PB12_PB13_PB14_PB15.2
PB15
  Top 0.305: U$2.P$4 U$35.1 PB12_PB13_PB14_PB15.1
PC13
  Top 0.305: U$2.P$39 VBAT_PC13_PC14_PC15_PA0_PA1.2 U$30.2
PC14
  Top 0.305: U$30.3 VBAT_PC13_PC14_PC15_PA0_PA1.3 U$2.P$38
PC15
  Top 0.305: U$2.P$37 VBAT_PC13_PC14_PC15_PA0_PA1.4 U$30.4
RST
  Top 0.305: U$1.P$24 RST_3V3_GND.1 U$24.1
RST1
  Top 0.305: U$2.P$24 PB10_PB11_RST_3V3_GND.3 U$26.3
RX
  Top 0.305: TX_RX_GND.2 74.96,45.71 U1.34
TOP
  pour Top: 0.08,0.08 242.49,0.08 242.49,71.04 0.08,71.04
TX
  Top 0.305: TX_RX_GND.3 U1.35
VBAT
  Top 1.016: U$18.1 VBAT_C13_C14_C15.1 U$1.P$40
VBAT1
  Top 1.016: U$30.1 VBAT_PC13_PC14_PC15_PA0_PA1.1 U$2.P$40
VN
  Top 0.305: JP2.4 3V3_EN_VP_VN.4 U1.4
VP
  Top 0.305: JP2.3 3V3_EN_VP_VN.3 U1.3
(copper drawn outside any net)
  shapes: Top area x2

### Text on the board
tPlace: IN | IN | OUT | OUT | IN | OUT